# Altium schematic sheet LoRa_Test_Board_Sheet.SchDoc
size A4; SheetNumber: 1; SheetTotal: 1
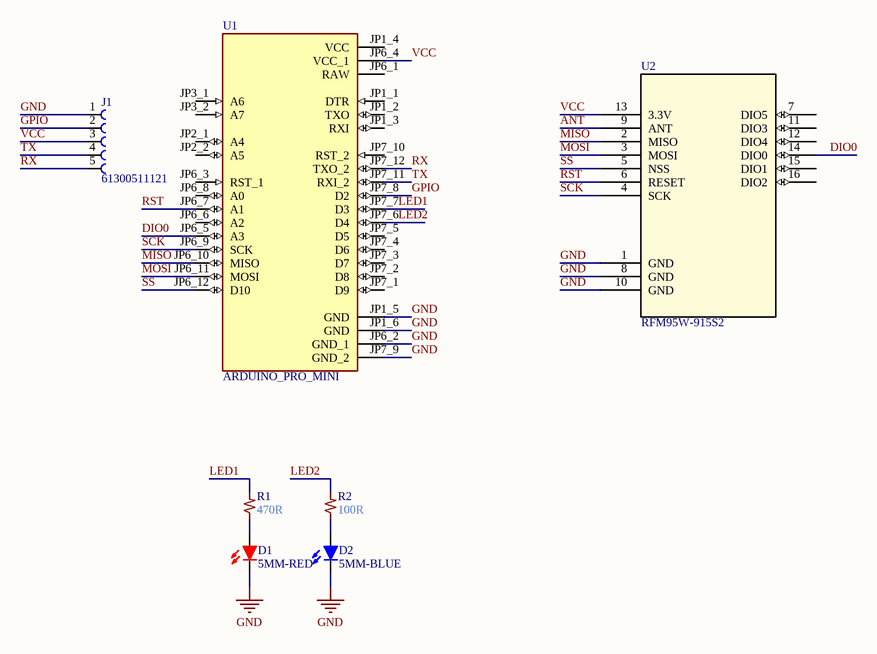
[diagram p0: LoRa_Test_Board_Sheet.SchDoc]

## Parts
D1  5MM-RED  [LED5MM-RED]
D2  5MM-BLUE  [LED5MM-BLUE]
J1  61300511121  [61300511121]
R1  470R  [R0603]
R2  100R  [R0603]
U1  ARDUINO_PRO_MINI  [MODULE_ARDUINO_PRO_MINI]
U2  RFM95W-915S2  [IC16_RFM95W-915S2_RFS]

## Nets
GND: D1.C D2.C J1.1 U1.JP1_5(GND) U1.JP1_6(GND) U1.JP6_2(GND_1) U1.JP7_9(GND_2) U2.1(GND) U2.8(GND) U2.10(GND)
ANT: U2.9(ANT)
DIO0: U1.JP6_5(A3) U2.14(DIO0)
GPIO: J1.2 U1.JP7_8(D2)
LED1: R1.2 U1.JP7_7(D3)
LED2: R2.2 U1.JP7_6(D4)
MISO: U1.JP6_10(MISO) U2.2(MISO)
MOSI: U1.JP6_11(MOSI) U2.3(MOSI)
RST: U1.JP6_7(A1) U2.6(RESET)
RX: J1.5 U1.JP7_12(TXO_2)
SCK: U1.JP6_9(SCK) U2.4(SCK)
SS: U1.JP6_12(D10) U2.5(NSS)
TX: J1.4 U1.JP7_11(RXI_2)
VCC: J1.3 U1.JP6_4(VCC_1) U2.13(3.3V)
NetD1_A: D1.A R1.1
NetD2_A: D2.A R2.1

Not connected (* = marked no-connect by the designer): U1 JP1_1(DTR) JP1_2(TXO) JP1_3(RXI) JP1_4(VCC) JP2_1(A4) JP2_2(A5) JP3_1(A6) JP3_2(A7) JP6_1(RAW) JP6_3(RST_1) JP6_6(A2) JP6_8(A0) JP7_1(D9) JP7_2(D8) JP7_3(D7) JP7_4(D6) JP7_5(D5) JP7_10(RST_2); U2 7(DIO5) 11(DIO3) 12(DIO4) 15(DIO1) 16(DIO2)

## Library data of the parts
D1 = LED5MM-RED: LED RED 5MM; Color: Red; ComponentLink1URL: https://datasheet.ciiva.com/29562/150141rs73100-29562993.pdf?src-supplier=Digi-Key; ComponentLink1Description: https://datasheet.ciiva.com/29562/150141rs73100-29562993.pdf?src-supplier=Digi-Key; ComponentLink2URL: https://datasheet.ciiva.com/29278/759464-da-01-en-smd-topled-einf-rot-150141rs73100-29278947.pdf?src-supplier=Conrad; ComponentLink2Description: https://datasheet.ciiva.com/29278/759464-da-01-en-smd-topled-einf-rot-150141rs73100-29278947.pdf?src-supplier=Conrad; ComponentLink3URL: https://datasheet.ciiva.com/29563/150141rs73100-29563031.pdf?src-supplier=Digi-Key; ComponentLink3Description: https://datasheet.ciiva.com/29563/150141rs73100-29563031.pdf?src-supplier=Digi-Key; ComponentLink4URL: https://datasheet.ciiva.com/29563/150141rs73100-29563032.pdf?src-supplier=Digi-Key; ComponentLink4Description: https://datasheet.ciiva.com/29563/150141rs73100-29563032.pdf?src-supplier=Digi-Key; Category: Optoelectronics
D2 = LED5MM-BLUE: LED BLUE 5MM; Color: BLUE; ComponentLink1URL: https://datasheet.ciiva.com/29562/150141rs73100-29562993.pdf?src-supplier=Digi-Key; ComponentLink1Description: https://datasheet.ciiva.com/29562/150141rs73100-29562993.pdf?src-supplier=Digi-Key; ComponentLink2URL: https://datasheet.ciiva.com/29278/759464-da-01-en-smd-topled-einf-rot-150141rs73100-29278947.pdf?src-supplier=Conrad; ComponentLink2Description: https://datasheet.ciiva.com/29278/759464-da-01-en-smd-topled-einf-rot-150141rs73100-29278947.pdf?src-supplier=Conrad; ComponentLink3URL: https://datasheet.ciiva.com/29563/150141rs73100-29563031.pdf?src-supplier=Digi-Key; ComponentLink3Description: https://datasheet.ciiva.com/29563/150141rs73100-29563031.pdf?src-supplier=Digi-Key; ComponentLink4URL: https://datasheet.ciiva.com/29563/150141rs73100-29563032.pdf?src-supplier=Digi-Key; ComponentLink4Description: https://datasheet.ciiva.com/29563/150141rs73100-29563032.pdf?src-supplier=Digi-Key; Category: Optoelectronics
J1 = 61300511121: Connector Header Through Hole 5 position 0.100 (2.54mm); MF: WÃ¼rth Elektronik; Check_prices: https://www.snapeda.com/parts/61300511121/Wurth+Elektronik/view-part/?ref=eda; Value: *; Purchase-URL: https://pricing.snapeda.com/search/part/61300511121/?ref=eda; Price: None; MP: 61300511121; SnapEDA_Link: https://www.snapeda.com/parts/61300511121/Wurth+Elektronik/view-part/?ref=snap; Availability: In Stock; Package: None
R1 = CRCW0603470RFKEA: RES SMD 470 OHM 1% 1/10W 0603; Manufacturer 1: Vishay; Power Rating: 100mW; Temperature Coefficient: 100ppm/°C; Voltage Rating: 75V; Supplier 1: Farnell; Supplier Part Number 1: 1469815; Manufacturer Part Number 1: CRCW0603470RFKEA; RoHS 1: Yes; Stock: 19745; Pricing 1: 10 = 0,01680, 250 = 0,01120, 1000 = 0,00700, 5000 = 0,00540 (EUR); Mount: Surface Mount; Case/Package: 0603; Weight: 7.1E-05oz; Case Code (Metric): 1608; Case Code (Imperial): 0603; Contact Plating: Lead,Tin; Min Operating Temperature: -55°C; Max Operating Temperature: 155°C; Tolerance: 1%; Packaging: Tape and Reel; Resistance: 470R; Composition: Thick Film; Package Quantity: 10; Termination: SMD/SMT; Number of Terminations: 2; Max Power Dissipation: 100mW; Voltage Rating (DC): 75V; Military Standard: Not; Features: Automotive AEC-Q200; Length: 1.55mm; Height: 0.45mm; Width: 0.033inch; Depth: 0.85mm; Radiation Hardening: No; REACH SVHC: Unknown; Lead Free: Lead Free; ComponentLink1URL: http://www.vishay.com/docs/20035/dcrcwe3.pdf; ComponentLink1Description: http://www.vishay.com/docs/20035/dcrcwe3.pdf; ComponentLink2URL: http://uk.rs-online.com/webdocs/13ec/0900766b813ecbec.pdf; ComponentLink2Description: http://uk.rs-online.com/webdocs/13ec/0900766b813ecbec.pdf; ComponentLink3URL: https://www.verical.com/server-webapp/html/getDatasheet?partID=45798; ComponentLink3Description: https://www.verical.com/server-webapp/html/getDatasheet?partID=45798; ComponentLink4URL: http://www.vishay.com/docs/20008/dcrcw.pdf; ComponentLink4Description: http://www.vishay.com/docs/20008/dcrcw.pdf; ComponentLink5URL: http://www.mouser.com/ds/2/427/dcrcwe3-109170.pdf; ComponentLink5Description: http://www.mouser.com/ds/2/427/dcrcwe3-109170.pdf; ComponentLink6URL: http://www.farnell.com/datasheets/2111203.pdf; ComponentLink6Description: http://www.farnell.com/datasheets/2111203.pdf; ComponentLink7URL: http://www.farnell.com/datasheets/2045673.pdf; ComponentLink7Description: http://www.farnell.com/datasheets/2045673.pdf; ComponentLink8URL: https://www.distrelec.biz/Web/Downloads/a_/en/flD-CRCW-e3_data_en.pdf?mime=application%2Fpdf; ComponentLink8Description: https://www.distrelec.biz/Web/Downloads/a_/en/flD-CRCW-e3_data_en.pdf?mime=application%2Fpdf; Description 1: RES SMD 470 OHM 1% 1/10W 0603; Category: Resistors
R2 = ERJ-P03F1000V: RESISTOR, SURGE, 0603, 1%, 100R; Manufacturer: Panasonic; Temperature Coefficient: 200ppm/°C; Power Rating: 200mW; Voltage Rating: 150V; Supplier 1: Digi-Key; Supplier Part Number 1: P16017CT-ND; Manufacturer Part Number: ERJ-P03F1000V; RoHS: Yes; Stock 1: 162; Pricing 1: 1 = 0,40000, 10 = 0,34200, 100 = 0,13360, 1000 = 0,05594, 2500 = 0,05127 (USD); Mount: Surface Mount; Case/Package: 0603; Number of Pins: 2; Case Code (Imperial): 0603; Case Code (Metric): 1608; Contact Plating: Tin; Min Operating Temperature: -55°C; Max Operating Temperature: 155°C; Resistance: 100R; Tolerance: 1%; Packaging: Tape and Reel; Composition: Thick Film; Termination: Tab; Military Standard: Not; Voltage Rating (DC): 150V; Package Quantity: 5000; Length: 1.6mm; Height: 0.45mm; Width: 0.8mm; Depth: 0.8mm; Radiation Hardening: No; REACH SVHC: No SVHC; ComponentLink1URL: https://datasheet.ciiva.com/11817/0900766b812cb812-11817071.pdf?src-supplier=RSComponents; ComponentLink1Description: https://datasheet.ciiva.com/11817/0900766b812cb812-11817071.pdf?src-supplier=RSComponents; ComponentLink2URL: https://datasheet.ciiva.com/24024/aoa0000ce4-64075-24024309.pdf?src-supplier=Mouser; ComponentLink2Description: https://datasheet.ciiva.com/24024/aoa0000ce4-64075-24024309.pdf?src-supplier=Mouser; ComponentLink3URL: https://datasheet.ciiva.com/9186/aoa0000ce4-9186919.pdf?src-supplier=Avnet; ComponentLink3Description: https://datasheet.ciiva.com/9186/aoa0000ce4-9186919.pdf?src-supplier=Avnet; ComponentLink4URL: https://datasheet.ciiva.com/48537/erjp-series-eng-tds-48537309.pdf?src-supplier=Distrelec; ComponentLink4Description: https://datasheet.ciiva.com/48537/erjp-series-eng-tds-48537309.pdf?src-supplier=Distrelec; ComponentLink5URL: https://datasheet.ciiva.com/7830/1790600-7830799.pdf?src-supplier=Element14; ComponentLink5Description: https://datasheet.ciiva.com/7830/1790600-7830799.pdf?src-supplier=Element14; ComponentLink6URL: https://datasheet.ciiva.com/48426/erjp-series-eng-tds-48426485.pdf?src-supplier=Distrelec; ComponentLink6Description: https://datasheet.ciiva.com/48426/erjp-series-eng-tds-48426485.pdf?src-supplier=Distrelec; ComponentLink7URL: https://datasheet.ciiva.com/17208/aoa0000ce4-17208006.pdf?src-supplier=Avnet+Europe; ComponentLink7Description: https://datasheet.ciiva.com/17208/aoa0000ce4-17208006.pdf?src-supplier=Avnet+Europe; Category: Resistors
U1 = ARDUINO_PRO_MINI: This board was developed for applications and installations where space is premium and projects are made as permanent set ups. Small, available in 3.3 V and 5 V versions, powered by ATmega328P.; MP: Arduino Pro Mini; Price: None; Availability: Not in stock; Package: None; Value: *; SnapEDA_Link: https://www.snapeda.com/parts/Arduino%20Pro%20Mini/Arduino/view-part/?ref=snap; MF: Arduino; Check_prices: https://www.snapeda.com/parts/Arduino%20Pro%20Mini/Arduino/view-part/?ref=eda
U2 = RFM95W-915S2: No Description Available; Mfr_Name: RF Solutions; Copyright: Copyright (C) 2023 Ultra Librarian. All rights reserved.; Manufacturer_Part_Number: RFM95W-915S2; RefDes: RefDes; Type: DEV